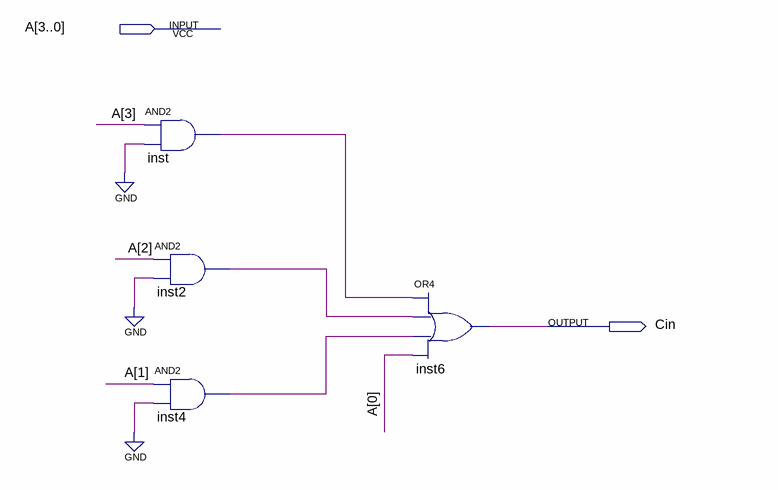
[diagram p0: schematic sheet]
// Quartus schematic 4TO1.bdf as structural Verilog: 4 symbols, 2 pins
module \4TO1  (
  input  [3:0] A,
  output Cin
);

  wire inst2_out, inst4_out, inst_out;

  and inst (inst_out, A[3], 1'b0);
  and inst2 (inst2_out, A[2], 1'b0);
  and inst4 (inst4_out, A[1], 1'b0);
  or inst6 (Cin, inst_out, inst2_out, inst4_out, A[0]);
endmodule
